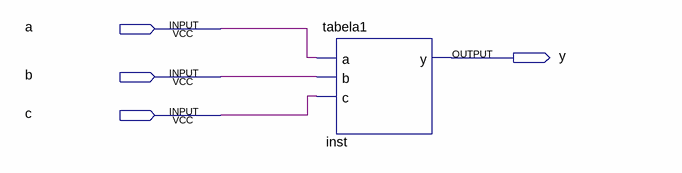
[diagram p0: schematic sheet]
// Quartus schematic tabela_verdade.bdf as structural Verilog: 1 symbols, 4 pins
module tabela_verdade (
  input  a,
  input  b,
  input  c,
  output y
);

  tabela1 inst (.a(a), .b(b), .c(c), .y(y));
endmodule
